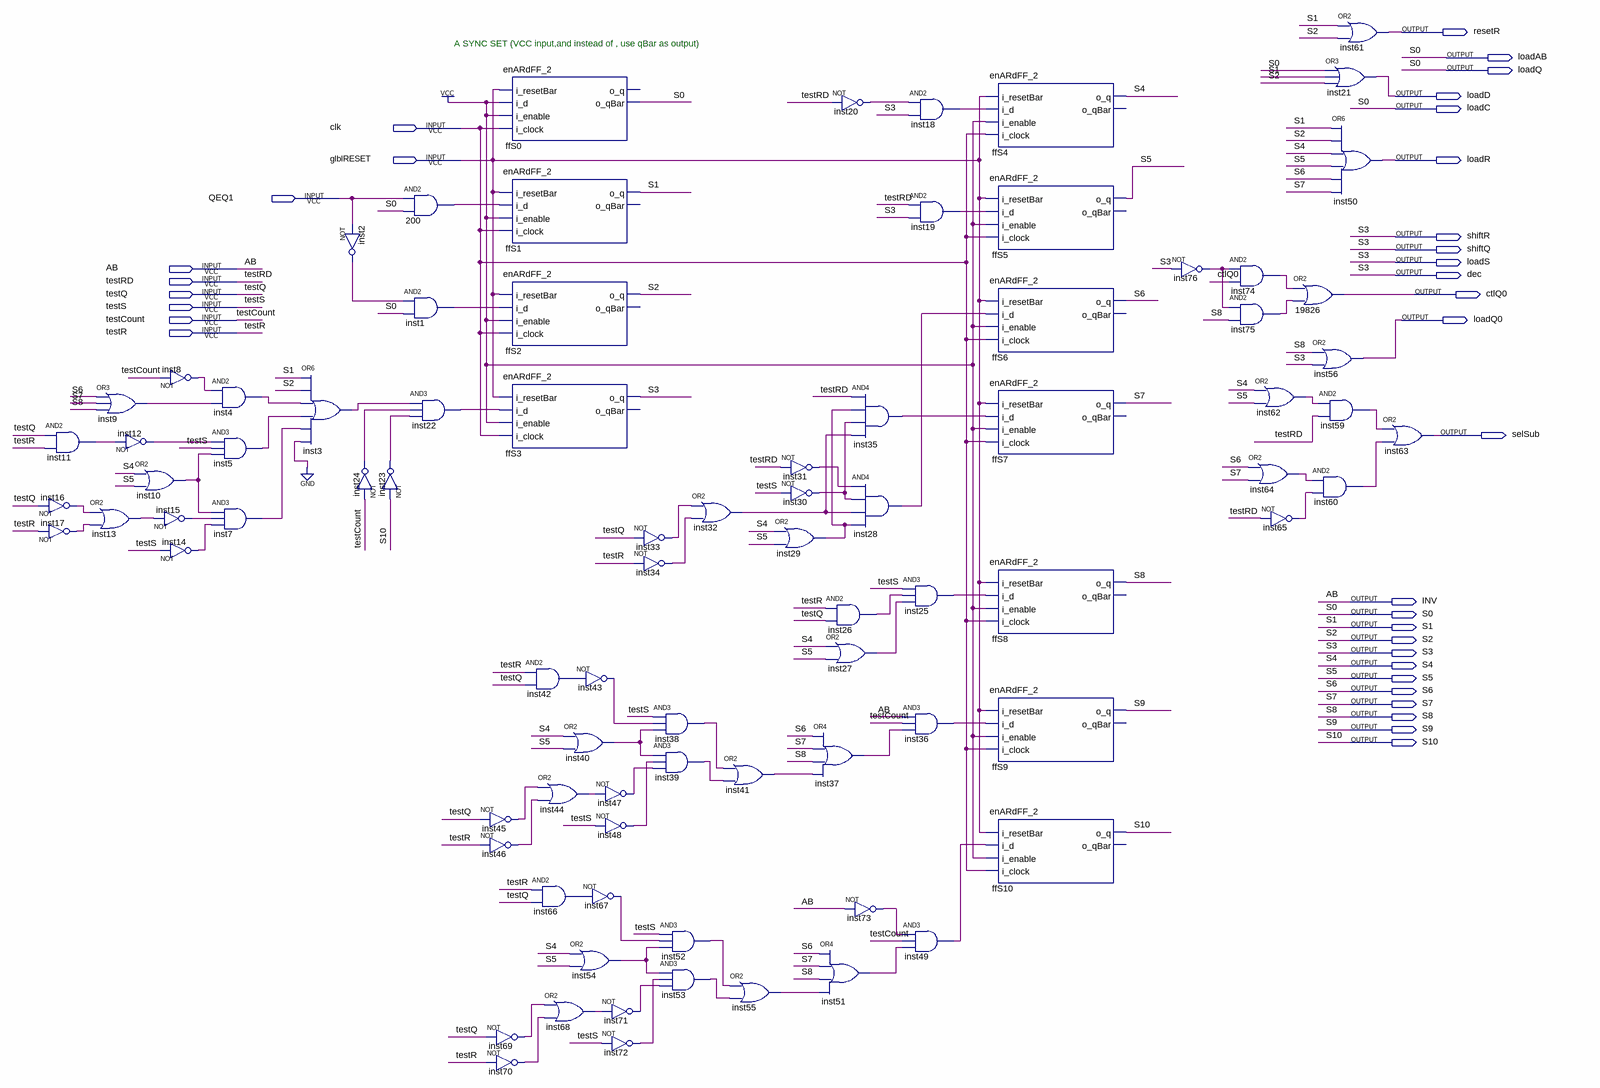
[diagram p0: schematic sheet]
// Quartus schematic controlpath.bdf as structural Verilog: 86 symbols, 34 pins
module controlpath (
  input  clk,
  input  glblRESET,
  input  QEQ1,
  input  AB,
  input  testRD,
  input  testQ,
  input  testS,
  input  testCount,
  input  testR,
  output resetR,
  output loadAB,
  output loadQ,
  output loadD,
  output loadC,
  output loadR,
  output shiftR,
  output shiftQ,
  output loadS,
  output dec,
  output ctlQ0,
  output loadQ0,
  output selSub,
  output INV,
  output S0,
  output S1,
  output S2,
  output S3,
  output S4,
  output S5,
  output S6,
  output S7,
  output S8,
  output S9,
  output S10
);

  wire inst1_out, inst2_out, inst3_out, inst4_out, inst5_out, inst7_out, inst8_out, inst9_out, inst10_out,
       inst11_out, inst12_out, inst13_out, inst14_out, inst15_out, inst16_out, inst17_out, inst18_out,
       inst19_out, inst20_out, inst22_out, inst23_out, inst24_out, inst25_out, inst26_out, inst27_out,
       inst28_out, inst29_out, inst30_out, inst31_out, inst32_out, inst33_out, inst34_out, inst35_out,
       inst36_out, inst37_out, inst38_out, inst39_out, inst40_out, inst41_out, inst42_out, inst43_out,
       inst44_out, inst45_out, inst46_out, inst47_out, inst48_out, inst49_out, inst51_out, inst52_out,
       inst53_out, inst54_out, inst55_out, inst59_out, inst60_out, inst62_out, inst64_out, inst65_out,
       inst66_out, inst67_out, inst68_out, inst69_out, inst70_out, inst71_out, inst72_out, inst73_out,
       inst74_out, inst75_out, inst76_out, n200_out;

  and inst11 (inst11_out, testQ, testR);
  not inst16 (inst16_out, testQ);
  not inst17 (inst17_out, testR);
  or inst9 (inst9_out, S6, S7, S8);
  or inst13 (inst13_out, inst16_out, inst17_out);
  not inst12 (inst12_out, inst11_out);
  or inst10 (inst10_out, S4, S5);
  not inst15 (inst15_out, inst13_out);
  not inst8 (inst8_out, testCount);
  not inst14 (inst14_out, testS);
  and inst4 (inst4_out, inst8_out, inst9_out);
  and inst5 (inst5_out, inst12_out, testS, inst10_out);
  and inst7 (inst7_out, inst10_out, inst15_out, inst14_out);
  or inst3 (inst3_out, S1, S2, inst4_out, inst5_out, inst7_out, 1'b0);
  not inst2 (inst2_out, QEQ1);
  not inst24 (inst24_out, testCount);
  and u_200 (n200_out, QEQ1, loadAB);
  and inst1 (inst1_out, inst2_out, loadAB);
  and inst22 (inst22_out, inst3_out, inst24_out, inst23_out);
  not inst23 (inst23_out, S10);
  enARdFF_2 ffS0 (.i_resetBar(glblRESET), .i_d(1'b1), .i_enable(1'b1), .i_clock(clk), .o_qBar(loadAB));  // open: o_q
  enARdFF_2 ffS1 (.i_resetBar(glblRESET), .i_d(n200_out), .i_enable(1'b1), .i_clock(clk), .o_q(S1));  // open: o_qBar
  enARdFF_2 ffS2 (.i_resetBar(glblRESET), .i_d(inst1_out), .i_enable(1'b1), .i_clock(clk), .o_q(S2));  // open: o_qBar
  enARdFF_2 ffS3 (.i_resetBar(glblRESET), .i_d(inst22_out), .i_enable(1'b1), .i_clock(clk), .o_q(dec));  // open: o_qBar
  not inst45 (inst45_out, testQ);
  not inst46 (inst46_out, testR);
  not inst69 (inst69_out, testQ);
  not inst70 (inst70_out, testR);
  and inst42 (inst42_out, testR, testQ);
  or inst40 (inst40_out, S4, S5);
  or inst44 (inst44_out, inst45_out, inst46_out);
  and inst66 (inst66_out, testR, testQ);
  or inst68 (inst68_out, inst69_out, inst70_out);
  not inst43 (inst43_out, inst42_out);
  not inst47 (inst47_out, inst44_out);
  not inst48 (inst48_out, testS);
  not inst67 (inst67_out, inst66_out);
  or inst54 (inst54_out, S4, S5);
  not inst71 (inst71_out, inst68_out);
  not inst72 (inst72_out, testS);
  not inst33 (inst33_out, testQ);
  not inst34 (inst34_out, testR);
  and inst38 (inst38_out, testS, inst43_out, inst40_out);
  and inst39 (inst39_out, inst40_out, inst48_out, inst47_out);
  and inst52 (inst52_out, testS, inst67_out, inst54_out);
  and inst53 (inst53_out, inst54_out, inst72_out, inst71_out);
  or inst32 (inst32_out, inst33_out, inst34_out);
  or inst41 (inst41_out, inst38_out, inst39_out);
  or inst55 (inst55_out, inst52_out, inst53_out);
  not inst31 (inst31_out, testRD);
  not inst30 (inst30_out, testS);
  or inst29 (inst29_out, S4, S5);
  or inst37 (inst37_out, S6, S7, S8, inst41_out);
  or inst51 (inst51_out, S6, S7, S8, inst55_out);
  not inst20 (inst20_out, testRD);
  and inst35 (inst35_out, testRD, inst29_out, inst30_out, inst32_out);
  and inst28 (inst28_out, inst31_out, inst30_out, inst32_out, inst29_out);
  and inst26 (inst26_out, testR, testQ);
  or inst27 (inst27_out, S4, S5);
  not inst73 (inst73_out, AB);
  and inst18 (inst18_out, inst20_out, dec);
  and inst19 (inst19_out, testRD, dec);
  and inst25 (inst25_out, testS, inst26_out, inst27_out);
  and inst36 (inst36_out, AB, testCount, inst37_out);
  and inst49 (inst49_out, inst73_out, testCount, inst51_out);
  enARdFF_2 ffS4 (.i_resetBar(glblRESET), .i_d(inst18_out), .i_enable(1'b1), .i_clock(clk), .o_q(S4));  // open: o_qBar
  enARdFF_2 ffS5 (.i_resetBar(glblRESET), .i_d(inst19_out), .i_enable(1'b1), .i_clock(clk), .o_q(S5));  // open: o_qBar
  enARdFF_2 ffS6 (.i_resetBar(glblRESET), .i_d(inst28_out), .i_enable(1'b1), .i_clock(clk), .o_q(S6));  // open: o_qBar
  enARdFF_2 ffS7 (.i_resetBar(glblRESET), .i_d(inst35_out), .i_enable(1'b1), .i_clock(clk), .o_q(S7));  // open: o_qBar
  enARdFF_2 ffS8 (.i_resetBar(glblRESET), .i_d(inst25_out), .i_enable(1'b1), .i_clock(clk), .o_q(S8));  // open: o_qBar
  enARdFF_2 ffS9 (.i_resetBar(glblRESET), .i_d(inst36_out), .i_enable(1'b1), .i_clock(clk), .o_q(S9));  // open: o_qBar
  enARdFF_2 ffS10 (
    .i_resetBar(glblRESET), .i_d(inst49_out), .i_enable(1'b1), .i_clock(clk), .o_q(S10));  // open: o_qBar
  not inst76 (inst76_out, dec);
  and inst74 (inst74_out, inst76_out, ctlQ0);
  and inst75 (inst75_out, inst76_out, S8);
  or inst62 (inst62_out, S4, S5);
  or inst64 (inst64_out, S6, S7);
  not inst65 (inst65_out, testRD);
  or inst21 (loadD, loadAB, S1, S2);
  or inst50 (loadR, S1, S2, S4, S5, S6, S7);
  or u_19826 (ctlQ0, inst74_out, inst75_out);
  or inst56 (loadQ0, S8, dec);
  and inst59 (inst59_out, inst62_out, testRD);
  and inst60 (inst60_out, inst64_out, inst65_out);
  or inst61 (resetR, S1, S2);
  or inst63 (selSub, inst59_out, inst60_out);

  assign INV = AB;
  assign loadC = loadAB;
  assign loadQ = loadAB;
  assign loadS = dec;
  assign S0 = loadAB;
  assign S3 = dec;
  assign shiftQ = dec;
  assign shiftR = dec;

  // Notes on the sheet:
  //   A SYNC SET (VCC input,and instead of , use qBar as output)
endmodule
